# Altium schematic sheet 04_External_RAM_Interface.SchDoc: Mainboard RAM
size A3; SheetNumber: 8; SheetTotal: 13
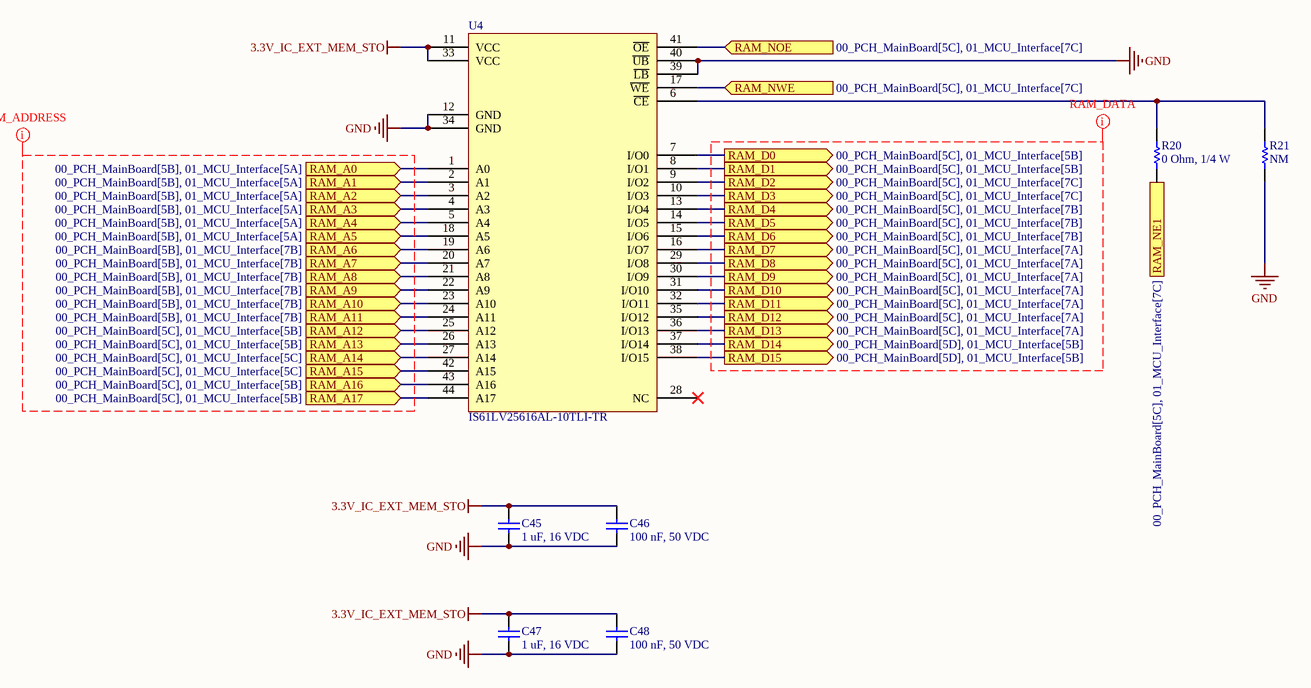
[diagram p0: 04_External_RAM_Interface.SchDoc]

## Parts
C45  1 uF, 16 VDC  [CAP_0603]
C46  100 nF, 50 VDC  [CAP_0603]
C47  1 uF, 16 VDC  [CAP_0603]
C48  100 nF, 50 VDC  [CAP_0603]
R20  0 Ohm, 1/4 W  [resistor_0603]
R21  NM  [resistor_0603]
U4  IS61LV25616AL-10TLI-TR  [IS61LV25616AL-10TLI-TR]

## Ports
RAM_A0 (in, see 00_PCH_MainBoard[5B], 01_MCU_Interface[5A]), RAM_A1 (in, see 00_PCH_MainBoard[5B], 01_MCU_Interface[5A]), RAM_A2 (in, see 00_PCH_MainBoard[5B], 01_MCU_Interface[5A]), RAM_A3 (in, see 00_PCH_MainBoard[5B], 01_MCU_Interface[5A]), RAM_A4 (in, see 00_PCH_MainBoard[5B], 01_MCU_Interface[5A]), RAM_A5 (in, see 00_PCH_MainBoard[5B], 01_MCU_Interface[5A]), RAM_A6 (in, see 00_PCH_MainBoard[5B], 01_MCU_Interface[7B]), RAM_A7 (in, see 00_PCH_MainBoard[5B], 01_MCU_Interface[7B]), RAM_A8 (in, see 00_PCH_MainBoard[5B], 01_MCU_Interface[7B]), RAM_A9 (in, see 00_PCH_MainBoard[5B], 01_MCU_Interface[7B]), RAM_A10 (in, see 00_PCH_MainBoard[5B], 01_MCU_Interface[7B]), RAM_A11 (in, see 00_PCH_MainBoard[5B], 01_MCU_Interface[7B]), RAM_A12 (in, see 00_PCH_MainBoard[5C], 01_MCU_Interface[5B]), RAM_A13 (in, see 00_PCH_MainBoard[5C], 01_MCU_Interface[5B]), RAM_A14 (in, see 00_PCH_MainBoard[5C], 01_MCU_Interface[5C]), RAM_A15 (in, see 00_PCH_MainBoard[5C], 01_MCU_Interface[5C]), RAM_A16 (in, see 00_PCH_MainBoard[5C], 01_MCU_Interface[5B]), RAM_A17 (in, see 00_PCH_MainBoard[5C], 01_MCU_Interface[5B]), RAM_D0 (out, see 00_PCH_MainBoard[5C], 01_MCU_Interface[5B]), RAM_D1 (out, see 00_PCH_MainBoard[5C], 01_MCU_Interface[5B]), RAM_D2 (out, see 00_PCH_MainBoard[5C], 01_MCU_Interface[7C]), RAM_D3 (out, see 00_PCH_MainBoard[5C], 01_MCU_Interface[7C]), RAM_D4 (out, see 00_PCH_MainBoard[5C], 01_MCU_Interface[7B]), RAM_D5 (out, see 00_PCH_MainBoard[5C], 01_MCU_Interface[7B]), RAM_D6 (out, see 00_PCH_MainBoard[5C], 01_MCU_Interface[7B]), RAM_D7 (out, see 00_PCH_MainBoard[5C], 01_MCU_Interface[7A]), RAM_D8 (out, see 00_PCH_MainBoard[5C], 01_MCU_Interface[7A]), RAM_D9 (out, see 00_PCH_MainBoard[5C], 01_MCU_Interface[7A]), RAM_D10 (out, see 00_PCH_MainBoard[5C], 01_MCU_Interface[7A]), RAM_D11 (out, see 00_PCH_MainBoard[5C], 01_MCU_Interface[7A]), RAM_D12 (out, see 00_PCH_MainBoard[5C], 01_MCU_Interface[7A]), RAM_D13 (out, see 00_PCH_MainBoard[5C], 01_MCU_Interface[7A]), RAM_D14 (out, see 00_PCH_MainBoard[5D], 01_MCU_Interface[5B]), RAM_D15 (out, see 00_PCH_MainBoard[5D], 01_MCU_Interface[5B]), RAM_NE1 (in, see 00_PCH_MainBoard[5C], 01_MCU_Interface[7C]), RAM_NOE (in, see 00_PCH_MainBoard[5C], 01_MCU_Interface[7C]), RAM_NWE (in, see 00_PCH_MainBoard[5C], 01_MCU_Interface[7C])

## Nets
3.3V_IC_EXT_MEM_STO: C45.2 C46.2 C47.2 C48.2 U4.11(VCC) U4.33(VCC)
GND: C45.1 C46.1 C47.1 C48.1 R21.2 U4.12(GND) U4.34(GND) U4.39(~{LB}) U4.40(~{UB})
RAM_A0: U4.1(A0) ; port RAM_A0
RAM_A1: U4.2(A1) ; port RAM_A1
RAM_A2: U4.3(A2) ; port RAM_A2
RAM_A3: U4.4(A3) ; port RAM_A3
RAM_A4: U4.5(A4) ; port RAM_A4
RAM_A5: U4.18(A5) ; port RAM_A5
RAM_A6: U4.19(A6) ; port RAM_A6
RAM_A7: U4.20(A7) ; port RAM_A7
RAM_A8: U4.21(A8) ; port RAM_A8
RAM_A9: U4.22(A9) ; port RAM_A9
RAM_A10: U4.23(A10) ; port RAM_A10
RAM_A11: U4.24(A11) ; port RAM_A11
RAM_A12: U4.25(A12) ; port RAM_A12
RAM_A13: U4.26(A13) ; port RAM_A13
RAM_A14: U4.27(A14) ; port RAM_A14
RAM_A15: U4.42(A15) ; port RAM_A15
RAM_A16: U4.43(A16) ; port RAM_A16
RAM_A17: U4.44(A17) ; port RAM_A17
RAM_D0: U4.7(I/O0) ; port RAM_D0
RAM_D1: U4.8(I/O1) ; port RAM_D1
RAM_D2: U4.9(I/O2) ; port RAM_D2
RAM_D3: U4.10(I/O3) ; port RAM_D3
RAM_D4: U4.13(I/O4) ; port RAM_D4
RAM_D5: U4.14(I/O5) ; port RAM_D5
RAM_D6: U4.15(I/O6) ; port RAM_D6
RAM_D7: U4.16(I/O7) ; port RAM_D7
RAM_D8: U4.29(I/O8) ; port RAM_D8
RAM_D9: U4.30(I/O9) ; port RAM_D9
RAM_D10: U4.31(I/O10) ; port RAM_D10
RAM_D11: U4.32(I/O11) ; port RAM_D11
RAM_D12: U4.35(I/O12) ; port RAM_D12
RAM_D13: U4.36(I/O13) ; port RAM_D13
RAM_D14: U4.37(I/O14) ; port RAM_D14
RAM_D15: U4.38(I/O15) ; port RAM_D15
RAM_NE1: R20.2 ; port RAM_NE1
RAM_NOE: U4.41(~{OE}) ; port RAM_NOE
RAM_NWE: U4.17(~{WE}) ; port RAM_NWE
NetR20_1: R20.1 R21.1 U4.6(~{CE})

Not connected (* = marked no-connect by the designer): U4 28(NC)*

## Layout directives
net class RAM_ADDRESS; rule Signal Stimulus [Kind - Periodic Pulse    Level - Low    Start Time = 0.000    Stop Time = 0.000    Period Time = 10.00n]: (no net found under the mark)
net class RAM_DATA; rule Signal Stimulus [Kind - Periodic Pulse    Level - Low    Start Time = 0.000    Stop Time = 0.000    Period Time = 10.00n]: (no net found under the mark)

## Notes on the sheet
- APPROVALS
- DATE
- PROJECT
- BOM:
- REFERENCE DOCUMENTS
- TITLE
- PROJECT REVISION
- DOCUMENT REVISION
- ASSY DWG:
- FAB DWG:
- PCB DWG:
- SIZE:
- A3
- FILE NAME:
- REV
- SHEET
- OF

## Library data of the parts
C45 C47 = 0106031051016: CAP, size 0603, 1 uF, 16 VDC; Manufacture Name: Samsung Electro-Mechanics; Manufacture SN: CL10B105KO8NNWC; Capacitance: 1 uF; Tolerance: +/-10%; Voltage Rating DC: 16 VDC; ComponentLink2Description: Datasheet; ComponentLink2URL: https://www.mouser.vn/datasheet/2/585/Samsung_MLCC_1837944-1929650.pdf; Operating Temperature: -55 to +125degC; Packaging: Tape and Reel; Mounting Technology: SMT; Size: 0603; Supplier 1 Name: Mouser; Supplier 1 SN: 187-CL10B105KO8NNWC; Supplier 1 URL: https://www.mouser.vn/ProductDetail/Samsung-Electro-Mechanics/CL10B105KO8NNWC?qs=81r%252BiQLm7BT%252BXtc72qn1ug%3D%3D&utm_source=mouser-refine-download&utm_medium=file&utm_campaign=CL10B105KO8NNWC&utm_content=Samsung-Electro-Mechanics; Supplier 2 Name: Digi-Key; Supplier 2 SN: 1276-CL10B105KO8NNWCTR-ND; Supplier 2 URL: https://www.digikey.com/en/products/detail/samsung-electro-mechanics/cl10b105ko8nnwc/16572783; Supplier 3 Name: thegioiic; Supplier 3 SN: N/A; Supplier 3 URL: https://www.thegioiic.com/tu-gom-0603-1uf-16v; Value: 1 uF, 16 VDC
C46 C48 = 0106031041050: CAP, size 0603, 100 nF, 50 VDC; Manufacture Name: TDK; Manufacture SN: CGA3E3X8R1H104K080AE; Capacitance: 100 nF; Tolerance: +/-10%; Voltage Rating DC: 50 VDC; ComponentLink2Description: Datasheet; ComponentLink2URL: https://product.tdk.com/system/files/dam/doc/product/capacitor/ceramic/mlcc/catalog/mlcc_automotive_soft_en.pdf?ref_disty=mouser; Operating Temperature: -55 to +125degC; Packaging: Tape and Reel; Mounting Technology: SMT; Size: 0603; Supplier 1 Name: Mouser; Supplier 1 SN: 810-CGA3E3X8R1H104KA; Supplier 1 URL: https://www.mouser.com/ProductDetail/TDK/CGA3E3X8R1H104K080AE?qs=nQSIdc08i%252Bd8g3IRRgU2bw%3D%3D&utm_source=mouser-refine-download&utm_medium=file&utm_campaign=CGA3E3X8R1H104K080AE&utm_content=TDK; Supplier 2 Name: Digi-Key; Supplier 2 SN: 445-173697-2-ND; Supplier 2 URL: https://www.digikey.com/en/products/detail/tdk-corporation/cga3e3x8r1h104k080ae/5809262; Supplier 3 Name: thegioiic; Supplier 3 SN: N/A; Supplier 3 URL: N/A; Value: 100 nF, 50 VDC
R20 = 0006030001: RES, size 0603, 0 Ohm, 1/4 W; Manufacture  Name: YAGEO; Manufacture  SN: AC0603FR-070RL; Resistance: 0 Ohm; Rated Power: 1/4 W; Resistance Tolerance: +/-1%; Size: 0603; Mounting Technology: SMT; Supplier 1 Name: Mouser; Supplier 1 SN: 603-AC0603FR-070RL; Supplier 2 Name: Digi-Key; Supplier 2 SN: 311-0.0LDTR-ND; Supplier 1 URL: https://www.mouser.com/ProductDetail/YAGEO/AC0603FR-070RL?qs=sGAEpiMZZMtlubZbdhIBIOG3KwTtqrl%2FD2D%252BGuMCfoY%3D; Supplier 3 Name: thegioiic; Supplier 3 SN: N/A; Supplier 3 URL: https://www.thegioiic.com/dien-tro-0-ohm-0603-1-; Value: 0 Ohm, 1/4 W; ComponentLink1Description: Datasheet link; ComponentLink1URL: https://www.mouser.com/datasheet/2/447/Yageo_06282023_ACseries-3224032.pdf; ComponentLink2Description: Supplier 1 URL; ComponentLink2URL: N/A; ComponentLink3Description: Supplier 2 URL; ComponentLink3URL: https://www.digikey.com/en/products/detail/yageo/ac0603fr-070rl/2827812; ComponentLink4Description: Supplier 3 URL; ComponentLink4URL: N/A; Supplier 2 URL: https://www.digikey.com/en/products/detail/yageo/ac0603fr-070rl/2827812
R21 = 000603_NM: RES, size 0603, NM; Resistance: NM; Size: 0603; Rated Power: N/A; Mounting Technology: SMT; Supplier 1 Name: Mouser; Supplier 1 SN: N/A; Supplier 2 Name: Digi-Key; Supplier 2 SN: N/A; Supplier 1 URL: N/A; Supplier 3 Name: thegioiic; Supplier 3 SN: N/A; Supplier 3 URL: N/A; Manufacture  Name: N/A; Manufacture  SN: N/A; Value: NM; ComponentLink1Description: Datasheet link; ComponentLink1URL: N/A; ComponentLink2Description: Supplier 1 URL; ComponentLink2URL: N/A; ComponentLink3Description: Supplier 2 URL; ComponentLink3URL: N/A; ComponentLink4Description: Supplier 3 URL; ComponentLink4URL: N/A; Resistance Tolerance: N/A; Supplier 2 URL: N/A
U4 = IS61LV25616AL-10TLI-TR: 256K x 16 HIGH SPEED ASYNCHRONOUS CMOS STATIC RAM WITH 3.3V SUPPLY; Manufacturer: ISSI; Active Read Current - Max: Active; Interface Type: Parallel; Maximum Clock Frequency: 100 MHz; Memory Size: 4 Mbit; Supply Voltage: 3.1 V - 3.6 V; ComponentLink1Description: Datasheet link; ComponentLink1URL: https://www.mouser.vn/datasheet/2/198/61LV25616AL-258498.pdf; ComponentLink2Description: Supplier 1 URL; ComponentLink2URL: https://www.mouser.vn/ProductDetail/ISSI/IS61LV25616AL-10TLI-TR?qs=YdQ7Kj7W0bwd5Hs%252BZkTrDw%3D%3D; ComponentLink3Description: Supplier 2 URL; ComponentLink3URL: https://www.digikey.com/en/products/detail/gigadevice-semiconductor-hk-limited/GD25Q64CSIGR/9484691?s=N4IgTCBcDaIOIBEwFYCKA2ALAYQMoEk4AlEAXQF8g; ComponentLink4Description: Supplier 3 URL; ComponentLink4URL: https://www.digikey.com/en/products/detail/issi-integrated-silicon-solution-inc/is61lv25616al-10tli-tr/1557305; IC Name: IS61LV25616AL-10TLI-TR; Mounting Style: SMD/SMT; Package: 44-TSOP; Supplier 1 Name: Mouser; Supplier 1 SN: 87061LV25616AL10TLIT; Supplier 1 URL: https://www.mouser.vn/ProductDetail/ISSI/IS61LV25616AL-10TLI-TR?qs=YdQ7Kj7W0bwd5Hs%252BZkTrDw%3D%3D; Supplier 2 Name: Digi-Key; Supplier 2 SN: 706-1305-2-ND; Supplier 2 URL: https://www.digikey.com/en/products/detail/gigadevice-semiconductor-hk-limited/GD25Q64CSIGR/9484691?s=N4IgTCBcDaIOIBEwFYCKA2ALAYQMoEk4AlEAXQF8g; Supplier 3 Name: thegioiic; Supplier 3 SN: N/A; Supplier 3 URL: https://www.digikey.com/en/products/detail/issi-integrated-silicon-solution-inc/is61lv25616al-10tli-tr/1557305; Value: IS61LV25616AL-10TLI-TR